# Altium schematic sheet Output_dig.SchDoc
size A4; DocumentNumber: 2; SheetNumber: 2; SheetTotal: 11
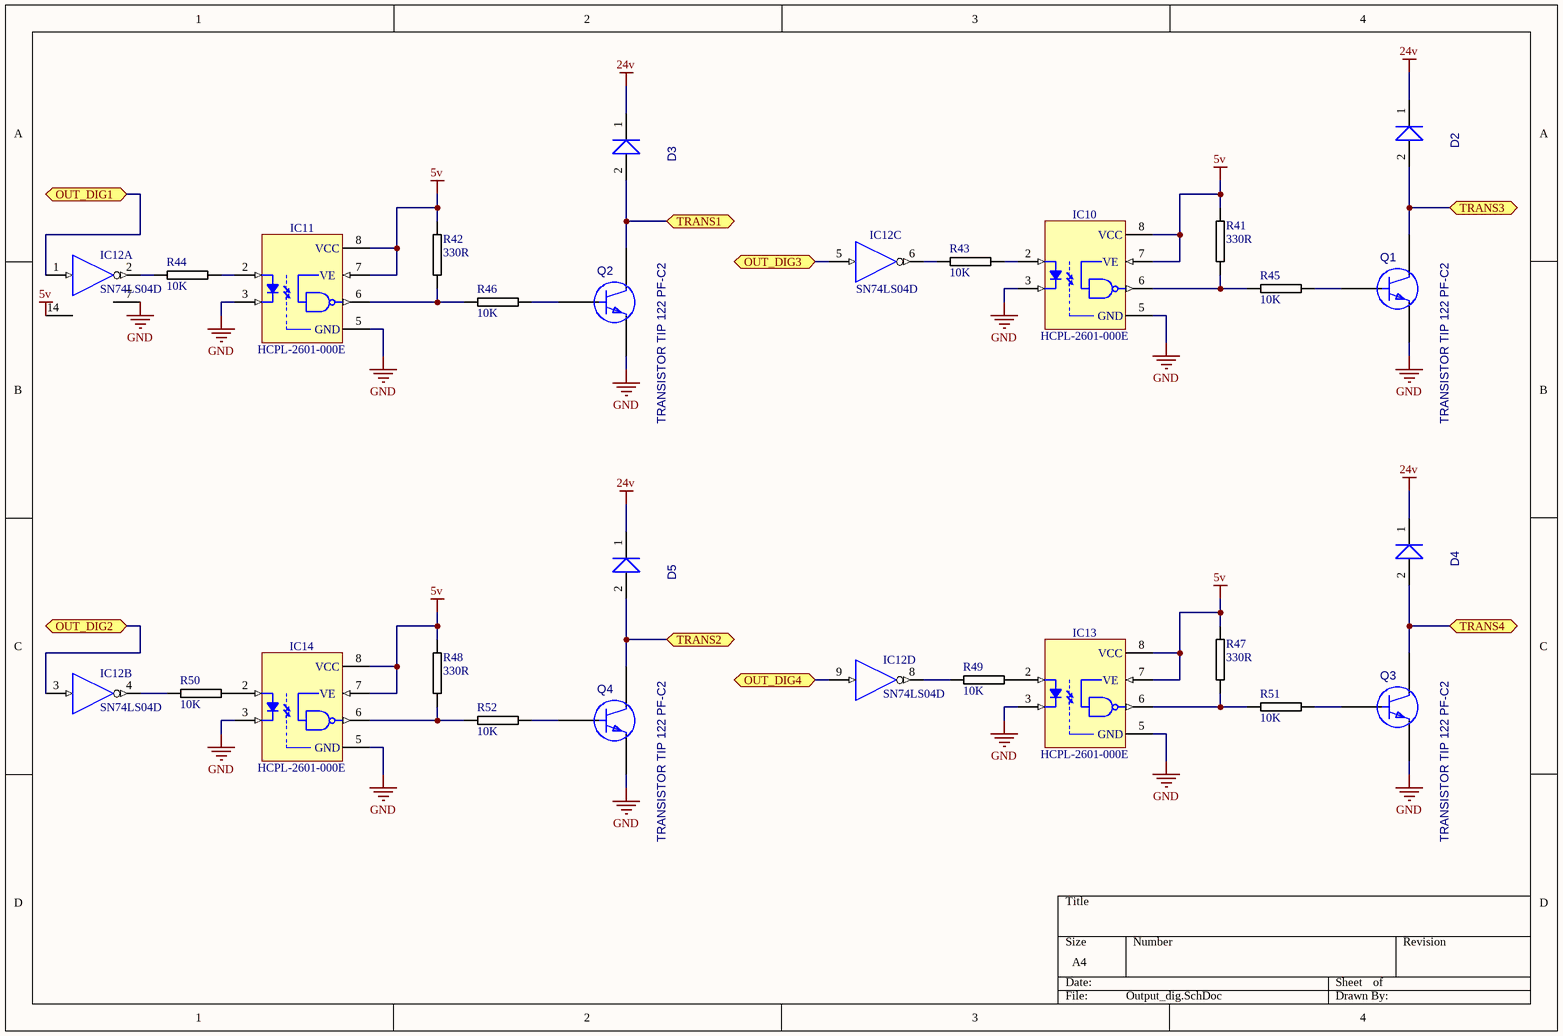
[diagram p0: Output_dig.SchDoc]

## Parts
D2  DIODO 1N4007 PF-B1  [DIODO DO41 PF-B1]  (value not drawn)
D3  DIODO 1N4007 PF-B1  [DIODO DO41 PF-B1]  (value not drawn)
D4  DIODO 1N4007 PF-B1  [DIODO DO41 PF-B1]  (value not drawn)
D5  DIODO 1N4007 PF-B1  [DIODO DO41 PF-B1]  (value not drawn)
IC10  HCPL-2601-000E  [DIP8-300]
IC11  HCPL-2601-000E  [DIP8-300]
IC12  SN74LS04D  [SOIC127P600X175-14N]  (parts A,B,C,D of 6)
IC13  HCPL-2601-000E  [DIP8-300]
IC14  HCPL-2601-000E  [DIP8-300]
Q1  TRANSISTOR TIP 122 PF-C2  [TRANSISTOR TO220 PF-C2]
Q2  TRANSISTOR TIP 122 PF-C2  [TRANSISTOR TO220 PF-C2]
Q3  TRANSISTOR TIP 122 PF-C2  [TRANSISTOR TO220 PF-C2]
Q4  TRANSISTOR TIP 122 PF-C2  [TRANSISTOR TO220 PF-C2]
R41  330R  [0805R-330]
R42  330R  [0805R-330]
R43  10K  [0805R-10K]
R44  10K  [0805R-10K]
R45  10K  [0805R-10K]
R46  10K  [0805R-10K]
R47  330R  [0805R-330]
R48  330R  [0805R-330]
R49  10K  [0805R-10K]
R50  10K  [0805R-10K]
R51  10K  [0805R-10K]
R52  10K  [0805R-10K]

## Ports
OUT_DIG1, OUT_DIG2, OUT_DIG3, OUT_DIG4, TRANS1, TRANS2, TRANS3, TRANS4

## Nets
5v: IC10.7(VE) IC10.8(VCC) IC11.7(VE) IC11.8(VCC) IC12.14(5v) IC13.7(VE) IC13.8(VCC) IC14.7(VE) IC14.8(VCC) R41.1 R42.1 R47.1 R48.1
24v: D2.1(K) D3.1(K) D4.1(K) D5.1(K)
GND: IC10.3(K) IC10.5(GND) IC11.3(K) IC11.5(GND) IC12.7(GND) IC13.3(K) IC13.5(GND) IC14.3(K) IC14.5(GND) Q1.3(E) Q2.3(E) Q3.3(E) Q4.3(E)
VCC: IC12.14(VCC)
OUT_DIG1: IC12.1(A) ; port OUT_DIG1
OUT_DIG2: IC12.3(A) ; port OUT_DIG2
OUT_DIG3: IC12.5(A) ; port OUT_DIG3
OUT_DIG4: IC12.9(A) ; port OUT_DIG4
TRANS1: D3.2(A) Q2.2(C) ; port TRANS1
TRANS2: D5.2(A) Q4.2(C) ; port TRANS2
TRANS3: D2.2(A) Q1.2(C) ; port TRANS3
TRANS4: D4.2(A) Q3.2(C) ; port TRANS4
NetIC10_2: IC10.2(A) R43.2
NetIC10_6: IC10.6(VO) R41.2 R45.1
NetIC11_2: IC11.2(A) R44.2
NetIC11_6: IC11.6(VO) R42.2 R46.1
NetIC12_2: IC12.2(~{O}) R44.1
NetIC12_4: IC12.4(~{O}) R50.1
NetIC12_6: IC12.6(~{O}) R43.1
NetIC12_8: IC12.8(~{O}) R49.1
NetIC13_2: IC13.2(A) R49.2
NetIC13_6: IC13.6(VO) R47.2 R51.1
NetIC14_2: IC14.2(A) R50.2
NetIC14_6: IC14.6(VO) R48.2 R52.1
NetQ1_1: Q1.1(B) R45.2
NetQ2_1: Q2.1(B) R46.2
NetQ3_1: Q3.1(B) R51.2
NetQ4_1: Q4.1(B) R52.2

## Library data of the parts
D2-D5 = DIODO 1N4007 PF-B1: cod: 606000120; Compra: 302003193; 3D comp: DIODO DO41 PF-B1; Descri: DIODO 1N4007 PF-B1; SCH: DIODO 1N4007 PF-B1
IC10 IC11 IC13 IC14 = HCPL-2601-000E: Single Optocoupler; Part Description: High CMR, High Speed TTL Compatible Optocouplers; Manufacturer: AVAGO TECHNOLOGIES; Table: Optocouplers; Part Number: HCPL-2601-000E; Component Kind: Standard; Component Type: Standard; Device: HCPL-2601-000E; PackageDescription: DIP; 8 Leads; Row Spacing 7.62 mm; Pitch 2.54 mm; Manufacturer Part Number: HCPL-2601-000E; Pin Count: 8; Case: DIP8-300; Mounted: Yes; Socket: Yes; SMD: No; ComponentHeight: 4.7mm; HelpURL: \\cern.ch\dfs\Applications\Altium\Datasheets\HCPL-2601-000E.pdf; Author: CERN DEM JLC; CreateDate: 30/03/2009; LatestRevisionDate: 30/03/2009
IC12 = SN74LS04D: Hex Inverter; Part Description: Hex Inverters; Manufacturer: TEXAS INSTRUMENTS; Table: Standard Logic; Part Number: SN74LS04D; Component Kind: Standard; Component Type: Standard; Device: SN74LS04D; PackageDescription: SOIC 14, Pitch 1.27mm - Body 4x8.75mm, IPC Medium Density; Manufacturer Part Number: SN74LS04D; Pin Count: 14; Case: SOIC14; Mounted: Yes; Socket: No; SMD: Yes; ComponentHeight: 1.75mm; Author: CERN DEM JLC; HelpURL: \\cern.ch\dfs\Applications\Altium\Datasheets\SN74LS04D.pdf; CreateDate: 20/05/2010; LatestRevisionDate: 20/05/2010
Q1-Q4 = TRANSISTOR TIP 122 PF-C2: cod: 606000213; Compra: 302003328; 3D comp: TRANSISTOR TO220 PF-C2; Descri: TRANSISTOR TIP 122 PF-C2; SCH: TRANSISTOR TIP 122 PF-C2
R41 R42 R47 R48 = 0805R-330: RESISTOR 0805 1/4 WATT THIN FILM; Reel: *
R43-R46 R49-R52 = 0805R-10K: RESISTOR 0805 1/4 WATT THIN FILM; Reel: *